# Altium schematic sheet RAM and target USB.SchDoc
size A; DocumentNumber: 3; SheetNumber: 3; SheetTotal: 6
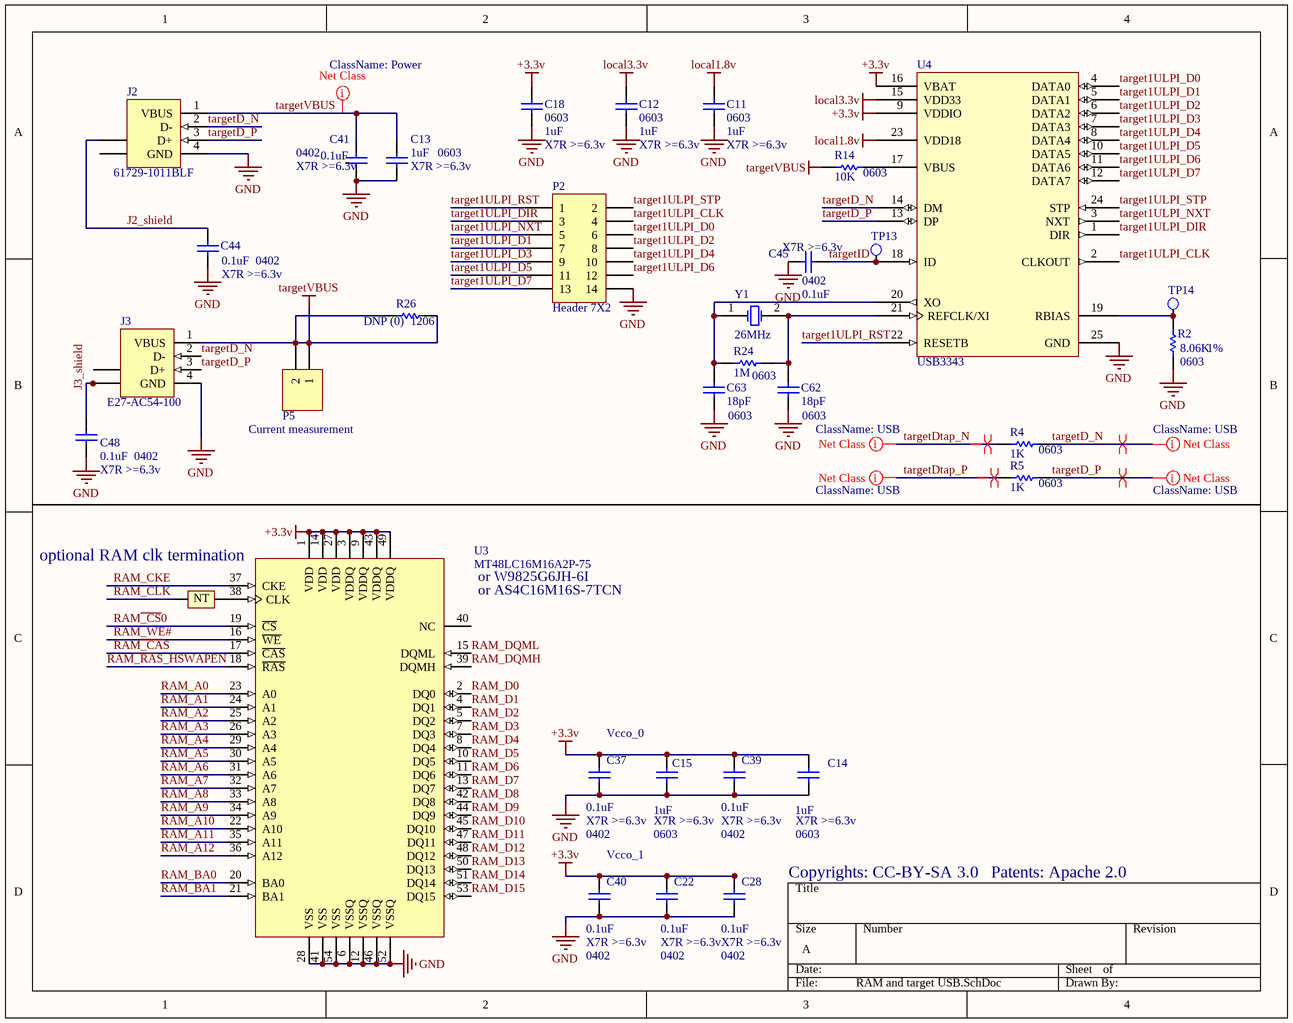
[diagram p0: RAM and target USB.SchDoc]

## Parts
C11  value 1uF  PackageReference: 0603  Rating: X7R >=6.3v  [CAPC1608N]  (hidden comment: Cap Semi)
C12  value 1uF  PackageReference: 0603  Rating: X7R >=6.3v  [CAPC1608N]  (hidden comment: Cap Semi)
C13  value 1uF  PackageReference: 0603  Rating: X7R >=6.3v  [CAPC1608N]  (hidden comment: Cap Semi)
C14  value 1uF  PackageReference: 0603  Rating: X7R >=6.3v  [CAPC1608N]  (hidden comment: Cap Semi)
C15  value 1uF  PackageReference: 0603  Rating: X7R >=6.3v  [CAPC1608N]  (hidden comment: Cap Semi)
C18  value 1uF  PackageReference: 0603  Rating: X7R >=6.3v  [CAPC1608N]  (hidden comment: Cap Semi)
C22  value 0.1uF  PackageReference: 0402  Rating: X7R >=6.3v  [CAPC1005N]  (hidden comment: Cap Semi)
C28  value 0.1uF  PackageReference: 0402  Rating: X7R >=6.3v  [CAPC1005N]  (hidden comment: Cap Semi)
C37  value 0.1uF  PackageReference: 0402  Rating: X7R >=6.3v  [CAPC1005N]  (hidden comment: Cap Semi)
C39  value 0.1uF  PackageReference: 0402  Rating: X7R >=6.3v  [CAPC1005N]  (hidden comment: Cap Semi)
C40  value 0.1uF  PackageReference: 0402  Rating: X7R >=6.3v  [CAPC1005N]  (hidden comment: Cap Semi)
C41  value 0.1uF  PackageReference: 0402  Rating: X7R >=6.3v  [CAPC1005N]  (hidden comment: Cap Semi)
C44  value 0.1uF  PackageReference: 0402  Rating: X7R >=6.3v  [CAPC1005N]  (hidden comment: Cap Semi)
C45  value 0.1uF  PackageReference: 0402  Rating: X7R >=6.3v  [CAPC1005N]  (hidden comment: Cap Semi)
C48  value 0.1uF  PackageReference: 0402  Rating: X7R >=6.3v  [CAPC1005N]  (hidden comment: Cap Semi)
C62  value 18pF  PackageReference: 0603  [CAPC1608N]  (hidden comment: Cap Semi)
C63  value 18pF  PackageReference: 0603  [CAPC1608N]  (hidden comment: Cap Semi)
J2  value 61729-1011BLF  [1-1470156]  (hidden comment: 1-1470156-1)
J3  value E27-AC54-100  [787616]  (hidden comment: 787616-1)
NT1  Net Tie2  [NetTie 0603]  (value not drawn)  (net tie, no BOM)
P2  Header 7X2  [HDR2X7]  (no BOM)
P5  Current measurement  [HDR1X2]  (no BOM)
R2  value 8.06K  PackageReference: 0603  Rating: 1%  [RESC1608N]  (hidden comment: Res Semi)
R4  value 1K  PackageReference: 0603  [RESC1608N]  (hidden comment: Res Semi)
R5  value 1K  PackageReference: 0603  [RESC1608N]  (hidden comment: Res Semi)
R14  value 10K  PackageReference: 0603  [RESC1608N]  (hidden comment: Res Semi)
R24  value 1M  PackageReference: 0603  [RESC1608N]  (hidden comment: Res Semi)
R26  value DNP (0)  PackageReference: 1206  [RESC3216N]  (hidden comment: Res Semi)
TP13  Test Point  [testpoint]  (value not drawn)  (no BOM)
TP14  Test Point  [testpoint]  (value not drawn)  (no BOM)
U3  MT48LC16M16A2P-75  [TSOP2-54_N]
U4  USB3343  [SMSC USB334x QFN24]
Y1  26MHz  [HC49/4H_SMX]

## Nets
+3.3v: C14.2 C15.2 C18.1 C22.2 C28.2 C37.2 C39.2 C40.2 U3.1(VDD) U3.3(VDDQ) U3.9(VDDQ) U3.14(VDD) U3.27(VDD) U3.43(VDDQ) U3.49(VDDQ) U4.9(VDDIO) U4.16(VBAT)
GND: C11.2 C12.2 C13.1 C14.1 C15.1 C18.2 C22.1 C28.1 C37.1 C39.1 C40.1 C41.1 C44.1 C45.2 C48.1 C62.1 C63.1 J2.4(GND) J3.4(GND) P2.14 R2.1 U3.6(VSSQ) U3.12(VSSQ) U3.28(VSS) U3.41(VSS) U3.46(VSSQ) U3.52(VSSQ) U3.54(VSS) U4.25(GND)
local1.8v: C11.1 U4.23(VDD18)
local3.3v: C12.1 U4.15(VDD33)
targetVBUS: C13.2 C41.2 J2.1(VBUS) J3.1(VBUS) P5.1 P5.2 R14.2 R26.1 R26.2
J2_shield: C44.2 J2.5(SHLD)
J3_shield: C48.2 J3.6(SHLD)
RAM~{_CA}S: U3.17(~{CAS})
RAM~{_CS}0: U3.19(~{CS})
RAM~{_RA}S_HSWAPEN: U3.18(~{RAS})
RAM_A0: U3.23(A0)
RAM_A1: U3.24(A1)
RAM_A2: U3.25(A2)
RAM_A3: U3.26(A3)
RAM_A4: U3.29(A4)
RAM_A5: U3.30(A5)
RAM_A6: U3.31(A6)
RAM_A7: U3.32(A7)
RAM_A8: U3.33(A8)
RAM_A9: U3.34(A9)
RAM_A10: U3.22(A10)
RAM_A11: U3.35(A11)
RAM_A12: U3.36(A12)
RAM_BA0: U3.20(BA0)
RAM_BA1: U3.21(BA1)
RAM_CKE: U3.37(CKE)
RAM_CLK: NT1.1
RAM_D0: U3.2(DQ0)
RAM_D1: U3.4(DQ1)
RAM_D2: U3.5(DQ2)
RAM_D3: U3.7(DQ3)
RAM_D4: U3.8(DQ4)
RAM_D5: U3.10(DQ5)
RAM_D6: U3.11(DQ6)
RAM_D7: U3.13(DQ7)
RAM_D8: U3.42(DQ8)
RAM_D9: U3.44(DQ9)
RAM_D10: U3.45(DQ10)
RAM_D11: U3.47(DQ11)
RAM_D12: U3.48(DQ12)
RAM_D13: U3.50(DQ13)
RAM_D14: U3.51(DQ14)
RAM_D15: U3.53(DQ15)
RAM_DQMH: U3.39(DQMH)
RAM_DQML: U3.15(DQML)
RAM_WE#: U3.16(~{WE})
target1ULPI_CLK: P2.4 U4.2(CLKOUT)
target1ULPI_D0: P2.6 U4.4(DATA0)
target1ULPI_D1: P2.7 U4.5(DATA1)
target1ULPI_D2: P2.8 U4.6(DATA2)
target1ULPI_D3: P2.9 U4.7(DATA3)
target1ULPI_D4: P2.10 U4.8(DATA4)
target1ULPI_D5: P2.11 U4.10(DATA5)
target1ULPI_D6: P2.12 U4.11(DATA6)
target1ULPI_D7: P2.13 U4.12(DATA7)
target1ULPI_DIR: P2.3 U4.1(DIR)
target1ULPI_NXT: P2.5 U4.3(NXT)
target1ULPI_RST: P2.1 U4.22(RESETB)
target1ULPI_STP: P2.2 U4.24(STP)
targetD_N: J2.2(D-) J3.2(D-) R4.1 U4.14(DM)
targetD_P: J2.3(D+) J3.3(D+) R5.1 U4.13(DP)
targetDtap_N: R4.2
targetDtap_P: R5.2
targetID: C45.1 TP13.1(pin) U4.18(ID)
NetC62_2: C62.2 R24.1 U4.21(REFCLK/XI) Y1.2(OSC2)
NetC63_2: C63.2 R24.2 U4.20(XO) Y1.1(OSC1)
NetNT1_2: NT1.2 U3.38(CLK)
NetR2_2: R2.2 TP14.1(pin) U4.19(RBIAS)
NetR14_1: R14.1 U4.17(VBUS)

Not connected (* = marked no-connect by the designer): J2 6(SHLD); J3 5(SHLD); U3 40(NC)

## Layout directives
net class Power: targetVBUS
differential pair: targetD_N, targetD_P, targetDtap_N, targetDtap_P
net class USB: targetD_N, targetD_P, targetDtap_N, targetDtap_P

## Notes on the sheet
- (near U3) optional RAM clk termination
- (near U3) or W9825G6JH-6I
- (near U3) or AS4C16M16S-7TCN
- Vcco_0
- Vcco_1
- Copyrights: CC-BY-SA 3.0
- Patents: Apache 2.0
- (in symbol Net Tie2) NT

## Library data of the parts
C11 C12 C18 = Cap Semi: Capacitor (Semiconductor SIM Model); Substitutable: yes; Description: CAP CER 10000PF 6.3V X5R 0201; Tolerance: ±10%; Supplier 1: Digi-Key; Supplier Part Number 1: 445-4703-1-ND
C13-C15 = Cap Semi: Capacitor (Semiconductor SIM Model); Substitutable: yes; Supplier 1: Digi-Key; Supplier Part Number 1: 445-4703-1-ND
C22 C28 C40 = Cap Semi: Capacitor (Semiconductor SIM Model); Description: CAP CER 0.1UF 25V 10% X5R 0603; Tolerance: ±10%; Substitutable: yes; Supplier 1: Digi-Key; Supplier Part Number 1: 445-4703-1-ND; Supplier 2: Digi-Key; Supplier Part Number 2: 445-6854-1-ND
C37 C39 C41 C44 C45 C48 = Cap Semi: Capacitor (Semiconductor SIM Model); Substitutable: yes; Tolerance: ±10%; Supplier 1: Digi-Key; Supplier Part Number 1: 445-4703-1-ND; Supplier 2: Digi-Key; Supplier Part Number 2: 445-6854-1-ND
C62 C63 = Cap Semi: Capacitor (Semiconductor SIM Model); Rating: C0G >=6.3v; Substitutable: yes; Supplier 1: Digi-Key; Supplier Part Number 1: 445-1777-1-ND
J2 = 1-1470156-1: USB 1.1, Right Angle, Thru-Hole, B Type, Receptacle, 4 Position, White; Substitutable: no; PackageReference: 1-1470156
J3 = 787616-1: USB 1.1, Right Angle, Thru-Hole, A Type, Receptacle, 4 Position, Black; Substitutable: no
NT1 = Net Tie2: 0603 Net Tie to connect 2 different nets; Substitutable: DNP
P2 = Header 7X2: Header, 7-Pin, Dual row; Substitutable: DNP
P5 = Header 2: Header, 2-Pin; Substitutable: DNP
R2 = Res Semi: Semiconductor Resistor; Substitutable: yes; Supplier 1: Digi-Key; Supplier Part Number 1: 311-8.06KHRCT-ND
R4 R5 R14 R24 R26 = Res Semi: Semiconductor Resistor; Rating: 5%; Substitutable: yes
TP13 TP14 = Test Pad: Substitutable: DNP
U3 = MT48LC16M16A2P-75: 256Mb Synchronous High-Speed CMOS DRAM, 16Mb x 16Bit x 4 Banks, 54-Pin TSOP Pb-free, Commercial; Substitutable: no; PackageReference: TSOP2-54; Value: MT48LC16M16A2P-75; Supplier 1: Digi-Key; Supplier Part Number 1: 557-1059-1-ND; Supplier 2: Arrow; Supplier Part Number 2: 41315055S7057620N2406
U4 = USB3343: Hi-Speed USB Transceiver with 1.8V-3.3V ULPI Interface - MHz Reference Clock; Substitutable: no; PackageReference: QFN-24; Value: USB3343
Y1 = XTAL: Crystal Oscillator; Substitutable: yes; PackageReference: HS-49; Value: 26 MHz